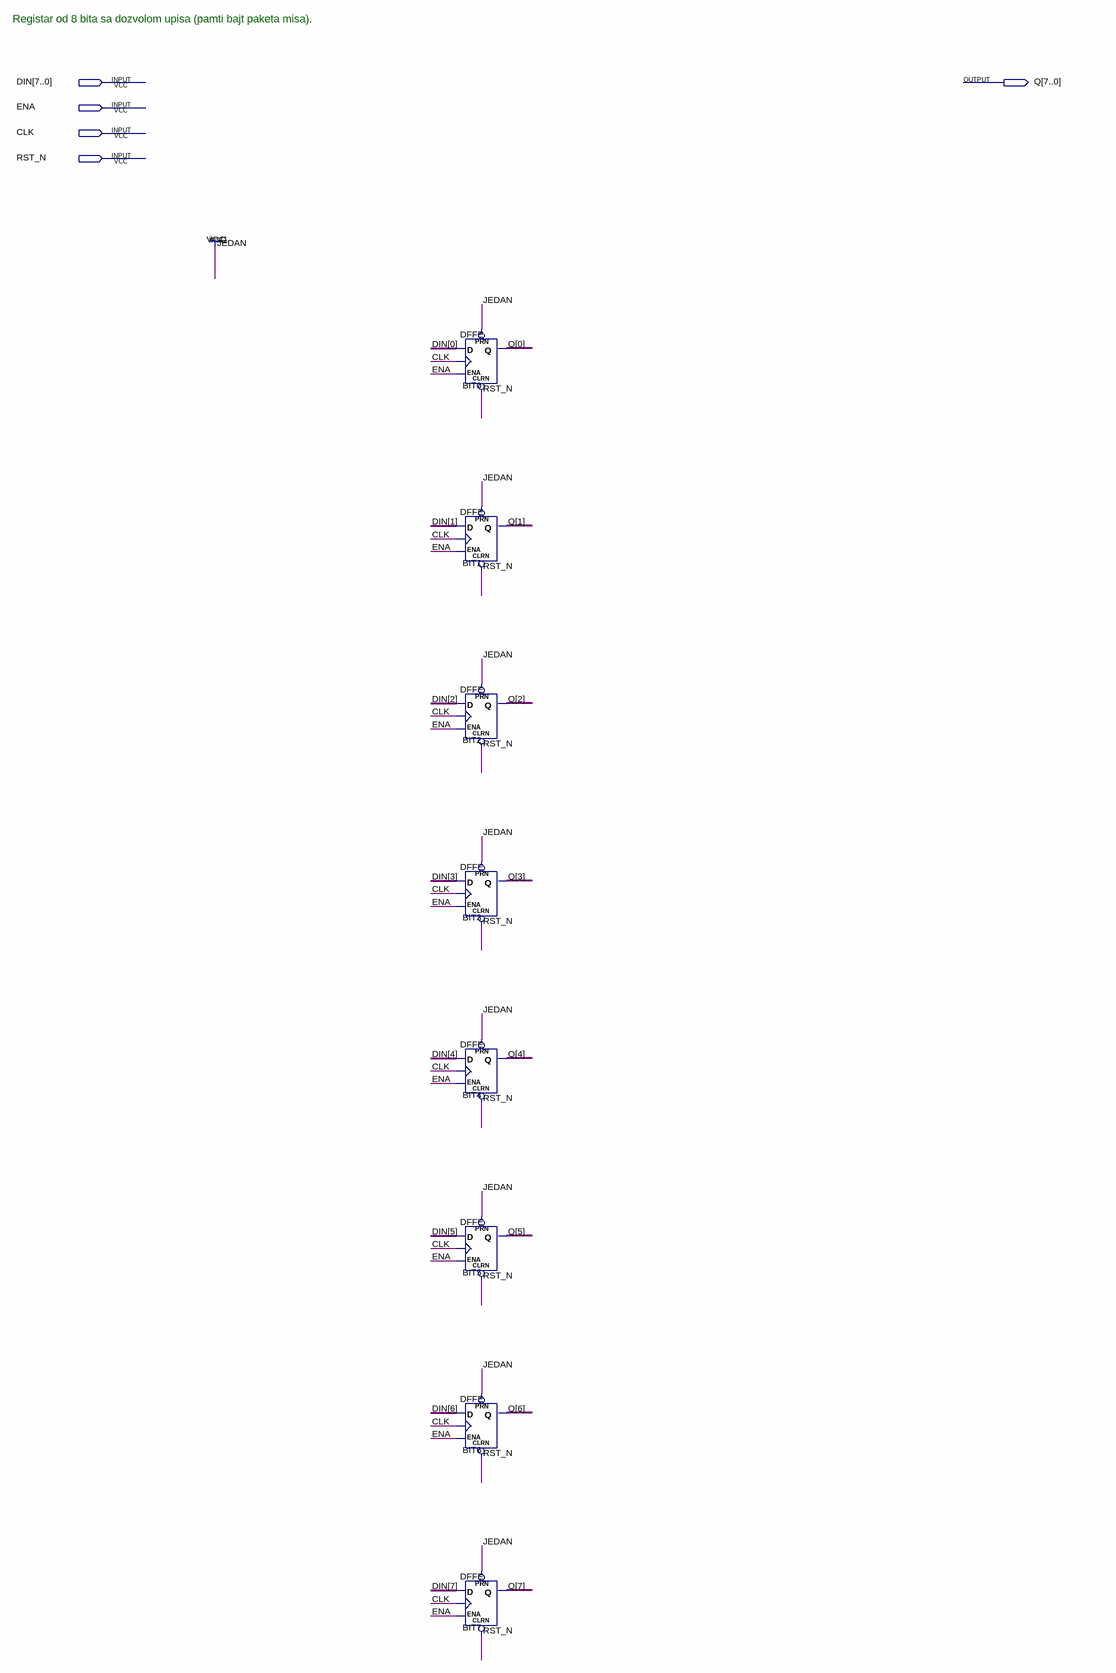
[diagram p0: schematic sheet]
// Quartus schematic reg8_en.bdf as structural Verilog: 8 symbols, 5 pins
module reg8_en (
  input  [7:0] DIN,
  input  ENA,
  input  CLK,
  input  RST_N,
  output [7:0] Q
);

  DFFE BIT0 (.PRN(1'b1), .CLRN(RST_N), .D(DIN[0]), .CLK(CLK), .ENA(ENA), .Q(Q[0]));
  DFFE BIT1 (.PRN(1'b1), .CLRN(RST_N), .D(DIN[1]), .CLK(CLK), .ENA(ENA), .Q(Q[1]));
  DFFE BIT2 (.PRN(1'b1), .CLRN(RST_N), .D(DIN[2]), .CLK(CLK), .ENA(ENA), .Q(Q[2]));
  DFFE BIT3 (.PRN(1'b1), .CLRN(RST_N), .D(DIN[3]), .CLK(CLK), .ENA(ENA), .Q(Q[3]));
  DFFE BIT4 (.PRN(1'b1), .CLRN(RST_N), .D(DIN[4]), .CLK(CLK), .ENA(ENA), .Q(Q[4]));
  DFFE BIT5 (.PRN(1'b1), .CLRN(RST_N), .D(DIN[5]), .CLK(CLK), .ENA(ENA), .Q(Q[5]));
  DFFE BIT6 (.PRN(1'b1), .CLRN(RST_N), .D(DIN[6]), .CLK(CLK), .ENA(ENA), .Q(Q[6]));
  DFFE BIT7 (.PRN(1'b1), .CLRN(RST_N), .D(DIN[7]), .CLK(CLK), .ENA(ENA), .Q(Q[7]));

  // Notes on the sheet:
  //   Registar od 8 bita sa dozvolom upisa (pamti bajt paketa misa).
endmodule
